# Altium project PCB_Project1.PrjPCB
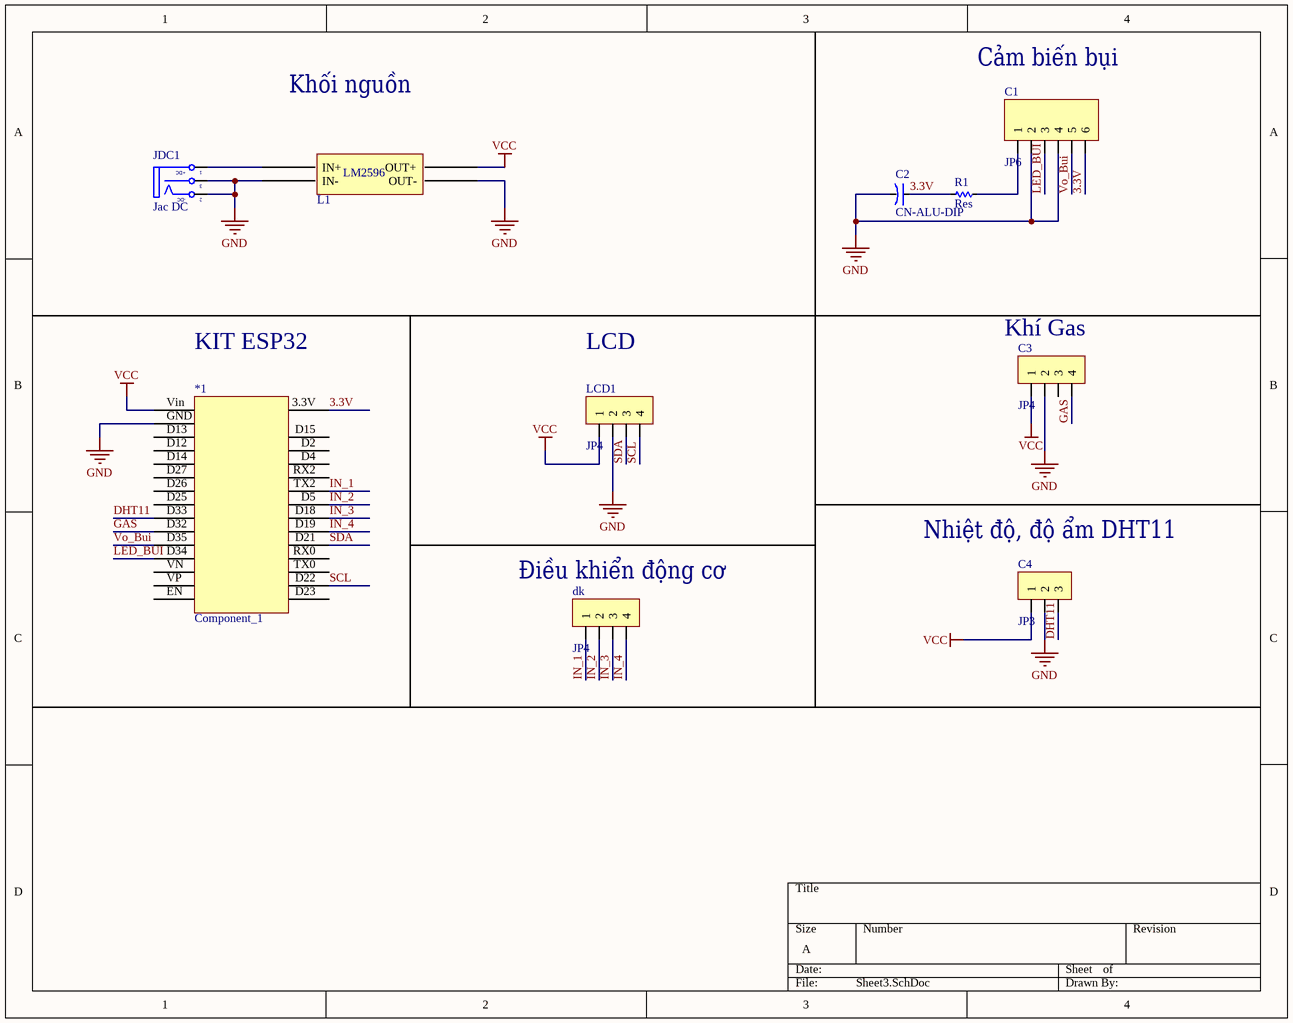
[diagram p0: Sheet3.SchDoc]
1 sheet, 10 parts. Net scope: global (net labels, ports and power ports of the same name join across sheets).
Board file: PCB3.PcbDoc

## Sheet Sheet3.SchDoc
size A

### Parts
*1  Component_1  [PCBComponent_1]
C1  JP6  [JP6-C1T]
C2  CN-ALU-DIP  [CA-ALU-2.54]
C3  JP4  [JP4-C1T]
C4  JP3  [JP3-C1T]
dk  JP4  [JP4-C1T]
JDC1  Jac DC  [DC0]
L1  BUCK_LM2596  [BUCK_LM2596]  (value not drawn)
LCD1  JP4  [JP4-C1T]
R1  Res  [RES-1/2W]

### Nets
GND: C1.2 C1.4 C2.2 C3.2 C4.2 JDC1.2(TN) JDC1.3(S) L1.2(IN-) L1.3(OUT-) LCD1.2
VCC: C3.1 C4.1 L1.4(OUT+) LCD1.1
3.3V: C1.6 C2.1 R1.1
DHT11: C4.3
GAS: C3.4
IN_1: dk.1
IN_2: dk.2
IN_3: dk.3
IN_4: dk.4
LED_BUI: C1.3
SCL: LCD1.4
SDA: LCD1.3
Vo_Bui: C1.5
NetC1_1: C1.1 R1.2
NetJDC1_1: JDC1.1(T) L1.1(IN+)

Not connected (* = marked no-connect by the designer): *1 3.3V(0) D2(3) D4(4) D5(7) D12(26) D13(27) D14(25) D15(2) D18(8) D19(9) D21(10) D22(13) D23(14) D25(22) D26(23) D27(24) D32(20) D33(21) D34(18) D35(19) EN(16) GND(1) RX0(11) RX2(5) TX0(12) TX2(6) Vin(29) VN(17) VP(15); C3 3

### Notes on the sheet
- Khối nguồn
- Cảm biến bụi
- KIT ESP32
- LCD
- (near C3) Khí Gas
- Nhiệt độ, độ ẩm DHT11
- (near dk) Điều khiển động cơ
- (in symbol BUCK_LM2596) LM2596
- (in symbol DCIN) +DC; -DC

### Library data of the parts
C1 = JP6: WR-PHD 2.54 mm Angled Socket Header; Manufacturer: W¨¹rth Elektronik eiSos GmbH; partNo: 613006143121; ComponentLink1 Description: Manufacturer; ComponentLink2 Description: Datasheet; NoPins: 06; Created Date: 29 March 2013; ComponentLink1URL: http://www.we-online.com; ComponentLink2URL: http://katalog.we-online.de/em/datasheet/6130xx143121.pdf; Created by: Karrer Zheng
C2 = CN-ALU-DIP: Capacitor (Semiconductor SIM Model); Value: 104; LatestRevisionDate: 17-Jul-2002; LatestRevisionNote: Re-released for DXP Platform.; PackageReference: C1206; Publisher: Altium Limited
C3 dk LCD1 = JP4: WR-PHD 2.54 mm Angled Socket Header; Manufacturer: W¨¹rth Elektronik eiSos GmbH; partNo: 613004143121; ComponentLink1 Description: Manufacturer; ComponentLink2 Description: Datasheet; NoPins: 04; Created Date: 29 March 2013; ComponentLink1URL: http://www.we-online.com; ComponentLink2URL: http://katalog.we-online.de/em/datasheet/6130xx143121.pdf; Created by: Karrer Zheng
C4 = JP3: WR-PHD 2.54 mm Angled Socket Header; Manufacturer: W¨¹rth Elektronik eiSos GmbH; partNo: 613003143121; ComponentLink1 Description: Manufacturer; ComponentLink2 Description: Datasheet; NoPins: 03; Created Date: 29 March 2013; ComponentLink1URL: http://www.we-online.com; ComponentLink2URL: http://katalog.we-online.de/em/datasheet/6130xx143121.pdf; Created by: Karrer Zheng
JDC1 = DCIN: Jac DC input; Value: Jac DC
R1 = Res: Manufacturer: Generic Components; Class: Passive; SubClass: R; Published: 08/06/2000; Publisher: Altium Hobart Technology Centre